# Altium schematic sheet AudioOutput.SchDoc
size 431 x 279 mm; Organization: ORGANIZATION; Address1: 207; Address2: 13399 104 Ave; Address3: Surrey BC, V3T 0C9; Address4: Canada; Revision: V0.0.0; SheetNumber: 4; SheetTotal: 5; ENG_APP_DATE: --/--/--; DSN_APP_DATE: --/--/--; CHK_APP_DATE: --/--/--
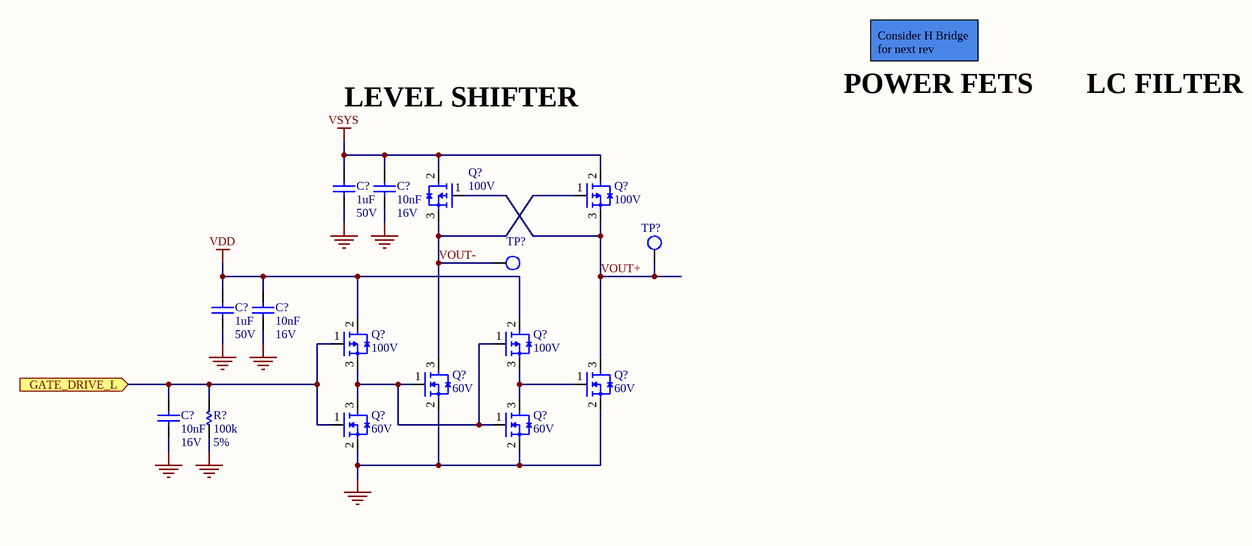
[diagram p0: AudioOutput.SchDoc]

## Parts
(Parts that share a designator on the sheet are numbered #1, #2 ... from top to bottom, then left to right.)
C?#1  1uF  Voltage Rating: 50V
C?#2  10nF  Voltage Rating: 16V  [c0402]
C?#3  1uF  Voltage Rating: 50V
C?#4  10nF  Voltage Rating: 16V  [c0402]
C?#5  10nF  Voltage Rating: 16V  [c0402]
Q?#1  100V  [SOT 23-3]
Q?#2  100V  [SOT 23-3]
Q?#3  100V  [SOT 23-3]
Q?#4  100V  [SOT 23-3]
Q?#5  60V  [SOT 23-3]
Q?#6  60V  [SOT 23-3]
Q?#7  60V  [SOT 23-3]
Q?#8  60V  [SOT 23-3]
R?  100k  Tolerance: 5%  [R0402]
TP?#1  1mm  [TESTPOINT_SMT]  (value not drawn)
TP?#2  1mm  [TESTPOINT_SMT]  (value not drawn)

## Ports
GATE_DRIVE_L (in)

## Nets
GND: C?#1.1 C?#2.1 C?#3.1 C?#4.1 C?#5.1 Q?#5.2(S) Q?#6.2(S) Q?#7.2(S) Q?#8.2(S) R?.1
VDD: C?#3.2 C?#4.2 Q?#3.2(S) Q?#4.2(S)
VSYS: C?#1.2 C?#2.2 Q?#1.2(S) Q?#2.2(S)
GATE_DRIVE_L: C?#5.2 Q?#3.1(G) Q?#7.1(G) R?.2 ; port GATE_DRIVE_L
VOUT+: Q?#1.1(G) Q?#2.3(S) Q?#6.3(D) TP?#2.1
VOUT-: Q?#1.3(S) Q?#2.1(G) Q?#5.3(D) TP?#1.1
NetQ?#3_3: Q?#3.3(S) Q?#4.1(G) Q?#5.1(G) Q?#7.3(D) Q?#8.1(G)
NetQ?#4_3: Q?#4.3(S) Q?#6.1(G) Q?#8.3(D)

## Notes on the sheet
- LEVEL SHIFTER
- POWER FETS
- Consider H Bridge for next rev
- LC FILTER
- REV:
- PROJECT:
- DATE:
- TITLE
- SHEET
- OF
- DESIGNED:
- REVIEWED:

## Library data of the parts
C?#1 C?#3 = CAP CER 1uF 50V X5R 0603: Multilayer Ceramic Capacitors (High dielectric type), 50V, 1 uF, ± 10 %, 0603, X5R, RoHS; Manufacturer: Taiyo Yuden; Manufacturer Part Number: UMK107BJ105KA-T; Tolerance: 10%; Supplier 1: Digi-Key; RoHS: Yes; Category: Ceramic Capacitors; Stock 1: 955108; Pricing 1: 1=0.19000, 10=0.12900, 50=0.07760, 100=0.06560, 500=0.04484, 1000=0.03968 (USD); Mount: Surface Mount; Case/Package: 0603; Number of Pins: 2; Case Code (Metric): 1608; Case Code (Imperial): 0603; Contact Plating: Nickel; Min Operating Temperature: -55°C; Max Operating Temperature: 85°C; Capacitance: 1uF; Packaging: Tape and Reel; Package Quantity: 1; Dielectric: X5R; Voltage Rating (DC): 50V; Termination: SMD/SMT; Series: M; Construction: Flat; Length: 1.6mm; Width: 0.031inch; Height: 0.8mm; Depth: 0.8mm; Thickness: 0.035inch; Radiation Hardening: No; RoHS Compliant: Yes; REACH SVHC: Unknown; Halogen Free: Halogen Free; ComponentLink1URL: https://datasheet.ciiva.com/134/umk107bj105ka-t-ss-134740.pdf?src-supplier=Digi-Key; ComponentLink1Description: https://datasheet.ciiva.com/134/umk107bj105ka-t-ss-134740.pdf?src-supplier=Digi-Key; ComponentLink2URL: https://datasheet.ciiva.com/11601/umk107bj105ka-t-ss-11601811.pdf?src-supplier=Avnet; ComponentLink2Description: https://datasheet.ciiva.com/11601/umk107bj105ka-t-ss-11601811.pdf?src-supplier=Avnet; ComponentLink3URL: https://datasheet.ciiva.com/5744/1697715-5744913.pdf?src-supplier=Farnell; ComponentLink3Description: https://datasheet.ciiva.com/5744/1697715-5744913.pdf?src-supplier=Farnell; ComponentLink4URL: https://datasheet.ciiva.com/30199/43umk107bj105ka-t-30199791.pdf?src-supplier=Onlinecomponents.com; ComponentLink4Description: https://datasheet.ciiva.com/30199/43umk107bj105ka-t-30199791.pdf?src-supplier=Onlinecomponents.com; ComponentLink5URL: https://datasheet.ciiva.com/15922/336umk107bj105ka-t-15922611.pdf?src-supplier=Onlinecomponents.com; ComponentLink5Description: https://datasheet.ciiva.com/15922/336umk107bj105ka-t-15922611.pdf?src-supplier=Onlinecomponents.com; ComponentLink6URL: https://datasheet.ciiva.com/5427/mlcc-all-e-541559-5427036.pdf?src-supplier=Mouser; ComponentLink6Description: https://datasheet.ciiva.com/5427/mlcc-all-e-541559-5427036.pdf?src-supplier=Mouser; ComponentLink7URL: https://datasheet.ciiva.com/7975/mlcc-all-e-7975898.pdf?src-supplier=Element14; ComponentLink7Description: https://datasheet.ciiva.com/7975/mlcc-all-e-7975898.pdf?src-supplier=Element14; ComponentLink8URL: https://datasheet.ciiva.com/7975/1697715-7975608.pdf?src-supplier=Element14; ComponentLink8Description: https://datasheet.ciiva.com/7975/1697715-7975608.pdf?src-supplier=Element14; ComponentLink9URL: https://datasheet.ciiva.com/22694/1697715-22694278.pdf?src-supplier=Element14; ComponentLink9Description: https://datasheet.ciiva.com/22694/1697715-22694278.pdf?src-supplier=Element14; Supplier Part Number 1: 587-2400-1-ND
C?#2 C?#4 C?#5 = CAP CER 10nF 16V Y5V 0402: 0402 10 nF 16 V -20 / +80 % Tolerance Y5V SMT Multilayer Ceramic Capacitor; Manufacturer: Yageo; Manufacturer Part Number: CC0402ZRY5V7BB103; Tolerance: 80%; Insulation Resistance: 100GR; Supplier 1: Future Electronics; RoHS: Yes; Category: Ceramic Capacitors; Stock 1: 10000; Pricing 1: 10000=0.00340, 30000=0.00320, 100000=0.00300, 200000=0.00290, 400000=0.00270 (USD); Mount: Surface Mount; Case/Package: 0402; Number of Pins: 2; Case Code (Imperial): 0402; Case Code (Metric): 1005; Dielectric Material: Ceramic; Min Operating Temperature: -55°C; Max Operating Temperature: 85°C; Capacitance: 10nF; Packaging: Tape and Reel; Voltage Rating (DC): 16V; Dielectric: Y5V; Termination: SMD/SMT; Series: CC; Package Quantity: 10000; Construction: Flat; Length: 1mm; Width: 0.02inch; Height: 0.5mm; Depth: 0.5mm; Thickness: 0.022inch; Terminal Length: 0.225mm; Radiation Hardening: No; RoHS Compliant: Yes; Lead Free: Lead Free; REACH SVHC: No SVHC; Halogen Free: Halogen Free; ComponentLink1URL: https://datasheet.ciiva.com/144/mlccorderingcode-144484.pdf?src-supplier=Digi-Key; ComponentLink1Description: https://datasheet.ciiva.com/144/mlccorderingcode-144484.pdf?src-supplier=Digi-Key; ComponentLink2URL: https://datasheet.ciiva.com/144/mlccorderingcode-144485.pdf?src-supplier=Digi-Key; ComponentLink2Description: https://datasheet.ciiva.com/144/mlccorderingcode-144485.pdf?src-supplier=Digi-Key; ComponentLink3URL: https://datasheet.ciiva.com/144/mlccorderingcode-144486.pdf?src-supplier=Digi-Key; ComponentLink3Description: https://datasheet.ciiva.com/144/mlccorderingcode-144486.pdf?src-supplier=Digi-Key; ComponentLink4URL: https://datasheet.ciiva.com/11586/upy-gphc-y5v-6-3v-to-50v-5-11586517.pdf?src-supplier=Avnet; ComponentLink4Description: https://datasheet.ciiva.com/11586/upy-gphc-y5v-6-3v-to-50v-5-11586517.pdf?src-supplier=Avnet; ComponentLink5URL: https://datasheet.ciiva.com/5789/1132289-5789565.pdf?src-supplier=Farnell; ComponentLink5Description: https://datasheet.ciiva.com/5789/1132289-5789565.pdf?src-supplier=Farnell; ComponentLink6URL: https://datasheet.ciiva.com/5789/1132289-5789566.pdf?src-supplier=Farnell; ComponentLink6Description: https://datasheet.ciiva.com/5789/1132289-5789566.pdf?src-supplier=Farnell; ComponentLink7URL: https://datasheet.ciiva.com/17437/upy-gphc-y5v-6-3v-to-50v-5-17437221.pdf?src-supplier=Avnet+Europe; ComponentLink7Description: https://datasheet.ciiva.com/17437/upy-gphc-y5v-6-3v-to-50v-5-17437221.pdf?src-supplier=Avnet+Europe; ComponentLink8URL: https://datasheet.ciiva.com/8033/1132289-8033641.pdf?src-supplier=Element14; ComponentLink8Description: https://datasheet.ciiva.com/8033/1132289-8033641.pdf?src-supplier=Element14; ComponentLink9URL: https://datasheet.ciiva.com/8033/1132289-8033642.pdf?src-supplier=Element14; ComponentLink9Description: https://datasheet.ciiva.com/8033/1132289-8033642.pdf?src-supplier=Element14; Supplier Part Number 1: 1300987
Q?#1-Q?#4 = TRANS PMOS 100V SOT-23-3: DMP10H4D2S Series 100V 270 mA P-Channel Enhancement Mode Mosfet - SOT-23-3; Manufacturer: Diodes; Manufacturer Part Number: DMP10H4D2S-7; Continuous Drain Current (ID): 270mA; Rds On Max: 4.2R; Input Capacitance: 87pF; Max Power Dissipation: 380mW; Supplier 1: Digi-Key; RoHS: Yes; Category: MOSFETs; Stock 1: 1201; Pricing 1: 1=0.44000, 10=0.33100, 100=0.20650, 500=0.14128, 1000=0.10868 (USD); Mount: Surface Mount; Case/Package: TO-236-3; Min Operating Temperature: -55°C; Max Operating Temperature: 150°C; Packaging: Tape and Reel; Drain to Source Voltage (Vdss): 100V; ComponentLink1URL: http://www.farnell.com/datasheets/2814419.pdf?src-supplier=Farnell; ComponentLink1Description: http://www.farnell.com/datasheets/2814419.pdf?src-supplier=Farnell; ComponentLink2URL: http://www.mouser.com/ds/2/115/DMP10H4D2S-773915.pdf?src-supplier=Mouser; ComponentLink2Description: http://www.mouser.com/ds/2/115/DMP10H4D2S-773915.pdf?src-supplier=Mouser; ComponentLink3URL: https://www.diodes.com/assets/Datasheets/DMP10H4D2S.pdf?src-supplier=Digi-Key; ComponentLink3Description: https://www.diodes.com/assets/Datasheets/DMP10H4D2S.pdf?src-supplier=Digi-Key; ComponentLink4URL: http://www.farnell.com/datasheets/2814419.pdf?src-supplier=Element14; ComponentLink4Description: http://www.farnell.com/datasheets/2814419.pdf?src-supplier=Element14; ComponentLink5URL: http://www.farnell.com/datasheets/2814419.pdf?src-supplier=Newark; ComponentLink5Description: http://www.farnell.com/datasheets/2814419.pdf?src-supplier=Newark; Supplier Part Number 1: DMP10H4D2S-7DICT-ND
Q?#5-Q?#8 = TRANS NMOS 60V SOT-23-3: N-Channel 60 V 0.2 W Surface Mount 2.5 V Drive Silicon Power Mosfet - SOT-23; Manufacturer: Rohm; Manufacturer Part Number: RK7002BMT116; Rds On Max: 2.4R; Input Capacitance: 15pF; Continuous Drain Current (ID): 250mA; Max Power Dissipation: 200mW; Number of Channels: 1; Drain to Source Resistance: 1.7R; Gate to Source Voltage (Vgs): 20V; Fall Time: 28ns; Rise Time: 5ns; Turn-Off Delay Time: 18ns; Turn-On Delay Time: 3.5ns; FET Type: 1 N-Channel; Supplier 1: Digi-Key; RoHS: Yes; Category: MOSFETs; Stock 1: 68809; Pricing 1: 1=0.16000, 10=0.14900, 100=0.08100, 500=0.04986, 1000=0.03399 (USD); Mount: Surface Mount; Case/Package: TO-236-3; Max Operating Temperature: 150°C; Package Quantity: 3000; Packaging: Tape and Reel; Drain to Source Voltage (Vdss): 60V; Drain to Source Breakdown Voltage: 60V; Lead Free: Lead Free; RoHS Compliant: Yes; ComponentLink1URL: http://www.farnell.com/datasheets/2197948.pdf?src-supplier=Farnell; ComponentLink1Description: http://www.farnell.com/datasheets/2197948.pdf?src-supplier=Farnell; ComponentLink2URL: http://www.mouser.com/ds/2/348/rk7002bmt116-e-1018209.pdf?src-supplier=Mouser; ComponentLink2Description: http://www.mouser.com/ds/2/348/rk7002bmt116-e-1018209.pdf?src-supplier=Mouser; ComponentLink3URL: http://rohmfs.rohm.com/en/techdata_basic/transistor/taping/SST3_T116_taping.pdf?src-supplier=Digi-Key; ComponentLink3Description: http://rohmfs.rohm.com/en/techdata_basic/transistor/taping/SST3_T116_taping.pdf?src-supplier=Digi-Key; ComponentLink4URL: http://rohmfs.rohm.com/en/products/databook/datasheet/discrete/transistor/mosfet/rk7002bm.pdf?src-supplier=Avnet; ComponentLink4Description: http://rohmfs.rohm.com/en/products/databook/datasheet/discrete/transistor/mosfet/rk7002bm.pdf?src-supplier=Avnet; ComponentLink5URL: http://www.farnell.com/datasheets/2197948.pdf?src-supplier=Newark; ComponentLink5Description: http://www.farnell.com/datasheets/2197948.pdf?src-supplier=Newark; ComponentLink6URL: http://www.farnell.com/datasheets/2197948.pdf?src-supplier=Element14; ComponentLink6Description: http://www.farnell.com/datasheets/2197948.pdf?src-supplier=Element14; Supplier Part Number 1: RK7002BMT116CT-ND
R? = RES 100k 5% 63mW 0402: Res Thick Film 0402 100K Ohm 5% 1/16W ±200ppm/°C Molded SMD SMD; Manufacturer: TE Connectivity; Manufacturer Part Number: CRG0402J100K/10; Resistance: 100kR; Power Rating: 63mW; Voltage Rating (DC): 50V; Supplier 1: Digi-Key; RoHS: Yes; Category: Chip SMD Resistors; Stock 1: 463648; Pricing 1: 1=0.10000, 10=0.02000, 100=0.00820, 1000=0.00369, 2500=0.00320, 5000=0.00264 (USD); Mount: Surface Mount; Case/Package: 0402; Case Code (Imperial): 0402; Weight: 2.3E-05oz; Min Operating Temperature: -55°C; Max Operating Temperature: 125°C; Package Quantity: 10000; Packaging: Tape and Reel; Resistor Type: Thick Film; Number of Terminations: 2; Temperature Coefficient: 200ppm/°C; Max Power Dissipation: 63mW; Voltage Rating: 50V; Series: CRG, Neohm; Termination: SMD/SMT; Technology: THICK FILM; Construction: Rectangular; Resistance Tolerance: 5%; Length: 1mm; Width: 0.5mm; Height: 0.35mm; Depth: 0.5mm; Radiation Hardening: No; Military Standard: Not; ELV: Compliant; REACH SVHC: Unknown; RoHS Compliant: Yes; ComponentLink1URL: https://datasheet.ciiva.com/11810/0900766b800a696e-11810123.pdf?src-supplier=RSComponents; ComponentLink1Description: https://datasheet.ciiva.com/11810/0900766b800a696e-11810123.pdf?src-supplier=RSComponents; ComponentLink2URL: https://datasheet.ciiva.com/30197/eng-ds-1773204-e-30197534.pdf?src-supplier=Onlinecomponents.com; ComponentLink2Description: https://datasheet.ciiva.com/30197/eng-ds-1773204-e-30197534.pdf?src-supplier=Onlinecomponents.com; ComponentLink3URL: https://datasheet.ciiva.com/2529/eng-ds-1773204-i-2529694.pdf?src-supplier=Digi-Key; ComponentLink3Description: https://datasheet.ciiva.com/2529/eng-ds-1773204-i-2529694.pdf?src-supplier=Digi-Key; Supplier Part Number 1: A121521CT-ND
TP?#1 TP?#2 = TP 1mm: SMT testpoint